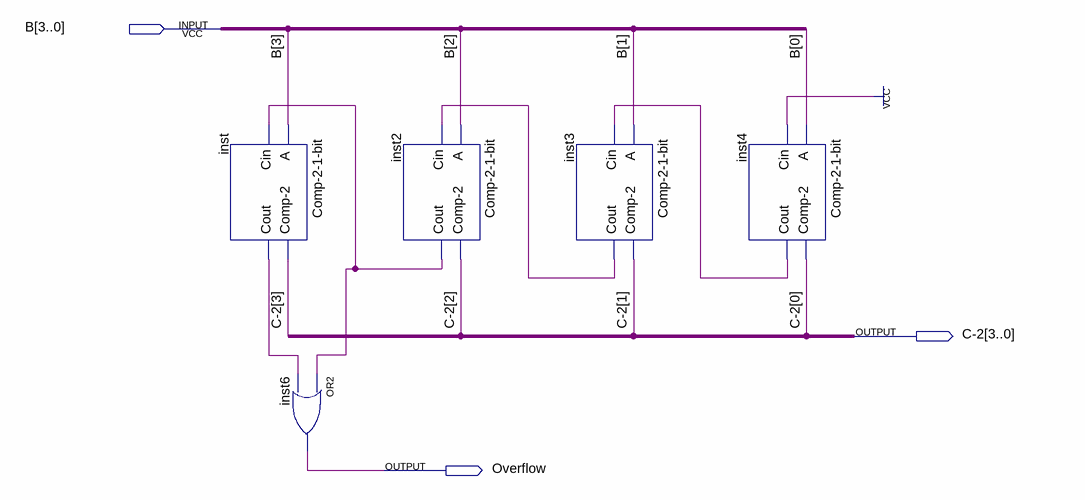
[diagram p0: schematic sheet]
// Quartus schematic Comp-2-4-bits.bdf as structural Verilog: 5 symbols, 3 pins
module \Comp-2-4-bits  (
  input  [3:0] B,
  output [3:0] \C-2 ,
  output Overflow
);

  wire inst2_cout, inst3_cout, inst4_cout, inst_cout;

  \Comp-2-1-bit  inst (.A(B[3]), .Cin(inst2_cout), .\Comp-2 (\C-2 [3]), .Cout(inst_cout));
  or inst6 (Overflow, inst2_cout, inst_cout);
  \Comp-2-1-bit  inst2 (.A(B[2]), .Cin(inst3_cout), .\Comp-2 (\C-2 [2]), .Cout(inst2_cout));
  \Comp-2-1-bit  inst3 (.A(B[1]), .Cin(inst4_cout), .\Comp-2 (\C-2 [1]), .Cout(inst3_cout));
  \Comp-2-1-bit  inst4 (.A(B[0]), .Cin(1'b1), .\Comp-2 (\C-2 [0]), .Cout(inst4_cout));
endmodule
